# EAGLE design elevator_iopanel_revA (EAGLE 9.4.0)
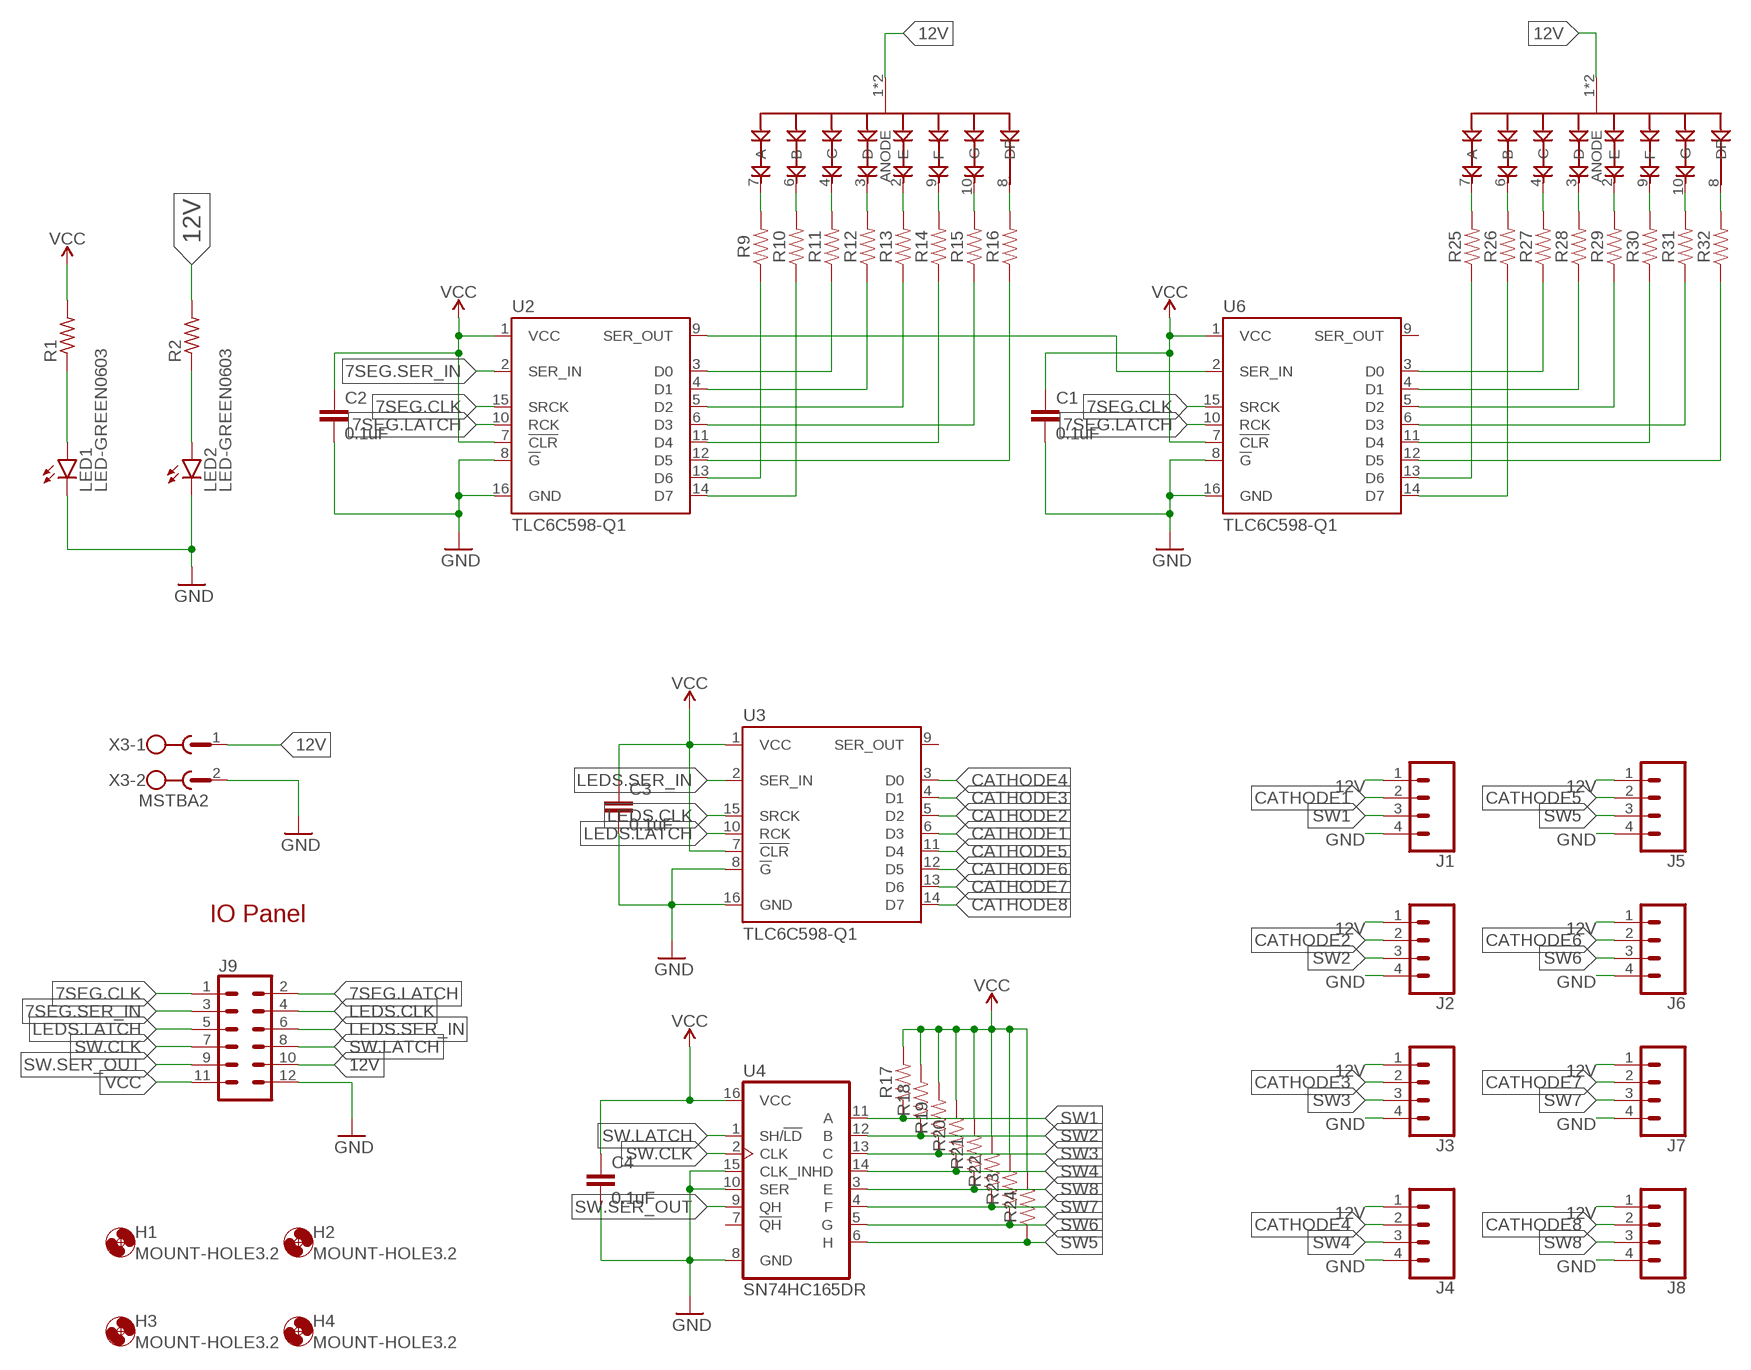
[diagram p0: schematic, sheet 1]

## Parts
C1  0.1uF  0.1UF-0603-25V-5%  [0603]
C2  0.1uF  0.1UF-0603-25V-5%  [0603]
C3  0.1uF  0.1UF-0603-25V-5%  [0603]
C4  0.1uF  0.1UF-0603-25V-5%  [0603]
D2  SA15-11EWA  [SA15-11EWA]
D4  SA15-11EWA  [SA15-11EWA]
H1  MOUNT-HOLE3.2  [3,2]
H2  MOUNT-HOLE3.2  [3,2]
H3  MOUNT-HOLE3.2  [3,2]
H4  MOUNT-HOLE3.2  [3,2]
J1  CONN_04LONGPADS  [1X04_LONGPADS]
J2  CONN_04LONGPADS  [1X04_LONGPADS]
J3  CONN_04LONGPADS  [1X04_LONGPADS]
J4  CONN_04LONGPADS  [1X04_LONGPADS]
J5  CONN_04LONGPADS  [1X04_LONGPADS]
J6  CONN_04LONGPADS  [1X04_LONGPADS]
J7  CONN_04LONGPADS  [1X04_LONGPADS]
J8  CONN_04LONGPADS  [1X04_LONGPADS]
J9  CONN_06X22X6SHR  [2X6-SHROUDED]
LED1  LED-GREEN0603  [0603-GREEN]
LED2  LED-GREEN0603  [0603-GREEN]
R1  R-US_R0603  [R0603]
R2  R-US_R0603  [R0603]
R9  20KOHM-0603-1/10W-1%  [0603]
R10  20KOHM-0603-1/10W-1%  [0603]
R11  20KOHM-0603-1/10W-1%  [0603]
R12  20KOHM-0603-1/10W-1%  [0603]
R13  20KOHM-0603-1/10W-1%  [0603]
R14  20KOHM-0603-1/10W-1%  [0603]
R15  20KOHM-0603-1/10W-1%  [0603]
R16  20KOHM-0603-1/10W-1%  [0603]
R17  20KOHM-0603-1/10W-1%  [0603]
R18  20KOHM-0603-1/10W-1%  [0603]
R19  20KOHM-0603-1/10W-1%  [0603]
R20  20KOHM-0603-1/10W-1%  [0603]
R21  20KOHM-0603-1/10W-1%  [0603]
R22  20KOHM-0603-1/10W-1%  [0603]
R23  20KOHM-0603-1/10W-1%  [0603]
R24  20KOHM-0603-1/10W-1%  [0603]
R25  20KOHM-0603-1/10W-1%  [0603]
R26  20KOHM-0603-1/10W-1%  [0603]
R27  20KOHM-0603-1/10W-1%  [0603]
R28  20KOHM-0603-1/10W-1%  [0603]
R29  20KOHM-0603-1/10W-1%  [0603]
R30  20KOHM-0603-1/10W-1%  [0603]
R31  20KOHM-0603-1/10W-1%  [0603]
R32  20KOHM-0603-1/10W-1%  [0603]
U2  TLC6C598-Q1  TPIC6C596SOIC  [SO16]
U3  TLC6C598-Q1  TPIC6C596SOIC  [SO16]
U4  SN74HC165DR  74HC165D  [SO16]
U6  TLC6C598-Q1  TPIC6C596SOIC  [SO16]
X3  MSTBA2  [MSTBA2]

## Nets
7SEG.CLK: J9.1 U2.15(SRCK) U6.15(SRCK)
7SEG.LATCH: J9.2 U2.10(RCK) U6.10(RCK)
7SEG.SER_IN: J9.3 U2.2(SER_IN)
12V: D2.1(ANODE) D2.5(ANODE) D4.1(ANODE) D4.5(ANODE) J1.1 J2.1 J3.1 J4.1 J5.1 J6.1 J7.1 J8.1 J9.10 R2.2 X3.1
A.SER_OUT: U2.9(SER_OUT) U6.2(SER_IN)
CATHODE1: J1.2 U3.6(D3)
CATHODE2: J2.2 U3.5(D2)
CATHODE3: J3.2 U3.4(D1)
CATHODE4: J4.2 U3.3(D0)
CATHODE5: J5.2 U3.11(D4)
CATHODE6: J6.2 U3.12(D5)
CATHODE7: J7.2 U3.13(D6)
CATHODE8: J8.2 U3.14(D7)
GND: C1.2 C2.2 C3.2 C4.2 J1.4 J2.4 J3.4 J4.4 J5.4 J6.4 J7.4 J8.4 J9.12 LED1.C LED2.C U2.8(!G) U2.16(GND) U3.8(!G) U3.16(GND) U4.8(GND) U4.10(SER) U4.15(CLK_INH) U6.8(!G) U6.16(GND) X3.2
LEDS.CLK: J9.4 U3.15(SRCK)
LEDS.LATCH: J9.5 U3.10(RCK)
LEDS.SER_IN: J9.6 U3.2(SER_IN)
N$1: LED1.A R1.1
N$2: LED2.A R2.1
N$17: D2.7(A) R9.2
N$18: D2.6(B) R10.2
N$19: D2.4(C) R11.2
N$20: D2.3(D) R12.2
N$21: D2.2(E) R13.2
N$22: D2.9(F) R14.2
N$23: D2.10(G) R15.2
N$24: D2.8(DP) R16.2
N$25: R11.1 U2.3(D0)
N$26: R12.1 U2.4(D1)
N$27: R13.1 U2.5(D2)
N$28: R15.1 U2.6(D3)
N$29: R14.1 U2.11(D4)
N$30: R16.1 U2.12(D5)
N$31: R9.1 U2.13(D6)
N$32: R10.1 U2.14(D7)
N$49: D4.7(A) R25.2
N$50: D4.6(B) R26.2
N$51: D4.4(C) R27.2
N$52: D4.3(D) R28.2
N$53: D4.2(E) R29.2
N$54: D4.9(F) R30.2
N$55: D4.10(G) R31.2
N$56: D4.8(DP) R32.2
N$57: R27.1 U6.3(D0)
N$58: R28.1 U6.4(D1)
N$59: R29.1 U6.5(D2)
N$60: R31.1 U6.6(D3)
N$61: R30.1 U6.11(D4)
N$62: R32.1 U6.12(D5)
N$63: R25.1 U6.13(D6)
N$64: R26.1 U6.14(D7)
SW1: J1.3 R17.1 U4.11(A)
SW2: J2.3 R18.1 U4.12(B)
SW3: J3.3 R19.1 U4.13(C)
SW4: J4.3 R20.1 U4.14(D)
SW5: J5.3 R24.1 U4.6(H)
SW6: J6.3 R23.1 U4.5(G)
SW7: J7.3 R22.1 U4.4(F)
SW8: J8.3 R21.1 U4.3(E)
SW.CLK: J9.7 U4.2(CLK)
SW.LATCH: J9.8 U4.1(SH/!LD)
SW.SER_OUT: J9.9 U4.9(QH)
VCC: C1.1 C2.1 C3.1 C4.1 J9.11 R1.2 R17.2 R18.2 R19.2 R20.2 R21.2 R22.2 R23.2 R24.2 U2.1(VCC) U2.7(!CLR) U3.1(VCC) U3.7(!CLR) U4.16(VCC) U6.1(VCC) U6.7(!CLR)
Unconnected: U3.9(SER_OUT) U4.7(!QH) U6.9(SER_OUT)

## Notes on the sheet
- IO Panel

## Library data of the parts
C1-C4 = SparkFun-Capacitors:0.1UF: 0.1µF ceramic capacitors A capacitor is a passive two-terminal electrical component used to store electrical energy temporarily in an electric field.; PROD_ID: CAP-08604
D2 D4 = shlomo:SA15-11EWA
H1-H4 = holes:MOUNT-HOLE: MOUNTING HOLE with drill center marker
J1-J8 = SparkFun-Connectors:CONN_04: Multi connection point. Often used as Generic Header-pin footprint for 0.1 inch spaced/style header connections On any of the 0.1 inch spaced packages, you can populate with these: Break Away Headers - Straight <https://www.sparkfun.com/products/116> (PRT-00116) Break Away Male Headers - Right Angle <https://www.sparkfun.com/products/553> (PRT-00553) Female Headers <https://www.sparkfun.com/products/115> (PRT-00115) Break Away Headers - Machine Pin <https://www.sparkfun.com/products/117> (PRT-00117) Break Away Female Headers - Swiss Machine Pin <https://www.sparkfun.com/products/743> (PRT-00743) For SCREWTERMINALS and SPRING TERMINALS visit here: Screw Terimnals on SparkFun.com <https://www.sparkfun.com/search/results?term=Screw+Terminals> (5mm/3.5mm/2.54mm spacing) This device is also useful as a general connection point to wire up your design to another part of your project. Our various solder wires solder well into these plated through hole pads. Hook-Up Wire - Assortment (Stranded, 22 AWG) <https://www.sparkfun.com/products/11375> (PRT-11375) Hook-Up Wire - Assortment (Solid Core, 22 AWG) <https://www.sparkfun.com/products/11367> (PRT-11367) View the entire wire category on our website here <https://www.sparkfun.com/categories/141> Special notes: Molex polarized connector foot print use with SKU : PRT-08231 with associated crimp pins and housings. 1MM SMD Version SKU: PRT-10208; PROD_ID: CONN-09696
J9 = SparkFun-Connectors:CONN_06X2: Multi connection point. Often used as Generic Header-pin footprint for 0.1 inch spaced/style header connections On any of the 0.1 inch spaced packages, you can populate with these: Break Away Headers - Straight <https://www.sparkfun.com/products/116> (PRT-00116) Break Away Male Headers - Right Angle <https://www.sparkfun.com/products/553> (PRT-00553) Female Headers <https://www.sparkfun.com/products/115> (PRT-00115) Break Away Headers - Machine Pin <https://www.sparkfun.com/products/117> (PRT-00117) Break Away Female Headers - Swiss Machine Pin <https://www.sparkfun.com/products/743> (PRT-00743)
LED1 LED2 = BeagleBone_Blue_R3:LED-GREEN
R1 R2 = adafruit:R-US_: RESISTOR, American symbol
R9-R32 = SparkFun-Resistors:20KOHM: 20kΩ resistor A resistor is a passive two-terminal electrical component that implements electrical resistance as a circuit element. Resistors act to reduce current flow, and, at the same time, act to lower voltage levels within circuits. - Wikipedia; PROD_ID: RES-09383; VALUE: 20k
U2 U3 U6 = SparkFun-IC-Logic:TPIC6C596: Serial in shift register with open collector outputs This can sink up to 100mA per channel Datasheet <https://cdn.sparkfun.com/datasheets/Widgets/TPIC6C596.pdf> SparkFun Products SparkFun Large Digit Driver <https://www.sparkfun.com/products/13279> (WIG-13279); PROD_ID: IC-12522; VALUE: TPIC6C596
U4 = SparkFun-IC-Logic:74*165: 8-Bit Shift Register (Parallel to Serial) Datasheet <https://cdn.sparkfun.com/datasheets/BreakoutBoards/sn54hc165.pdf> SparkFun Products SparkFun Shift-In Breakout - SN74HC165 <https://www.sparkfun.com/products/11733> (BOB-11733); PROD_ID: IC-11325
X3 = con-phoenix-508:MSTBA2: PHOENIX; MF: FARNELL; MPN: 1757242; OC_FARNELL: 3705171; OC_NEWARK: 71C4161

## Board
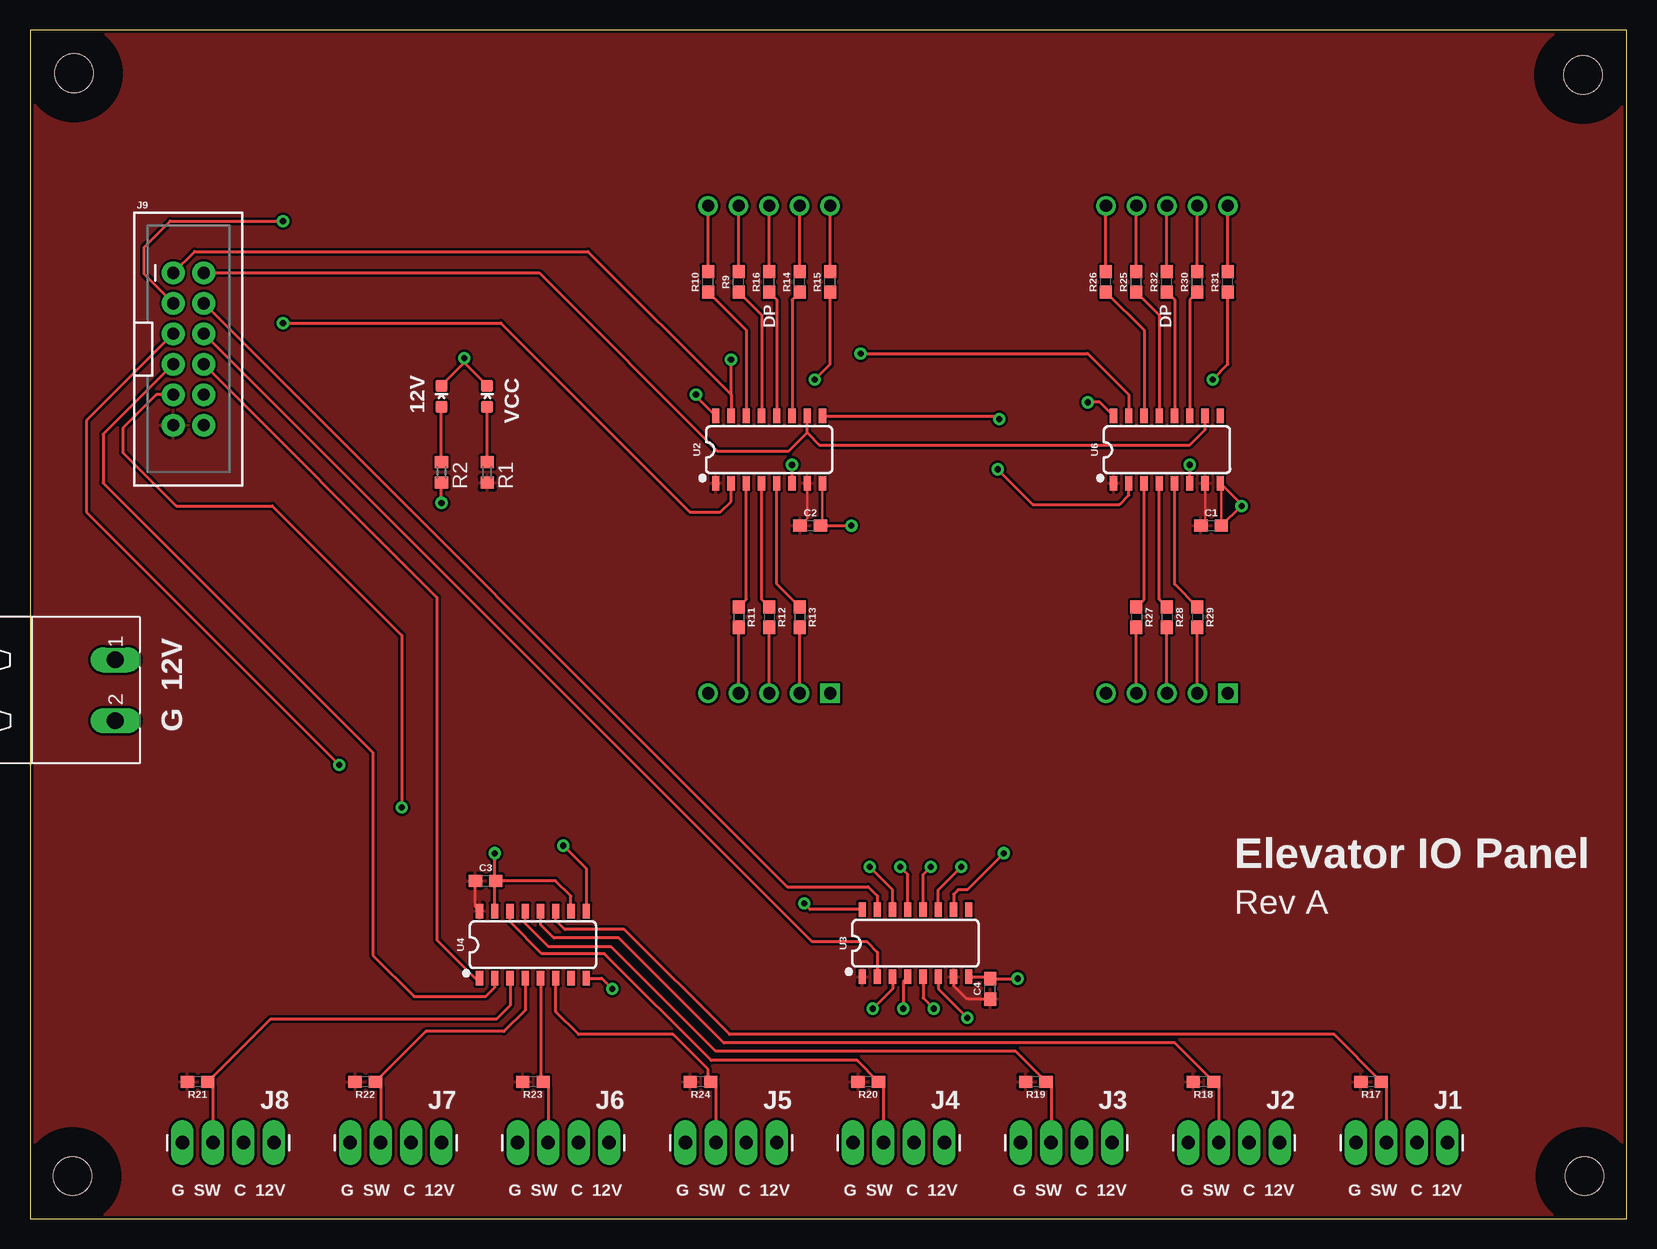
[diagram p1: board, top side]
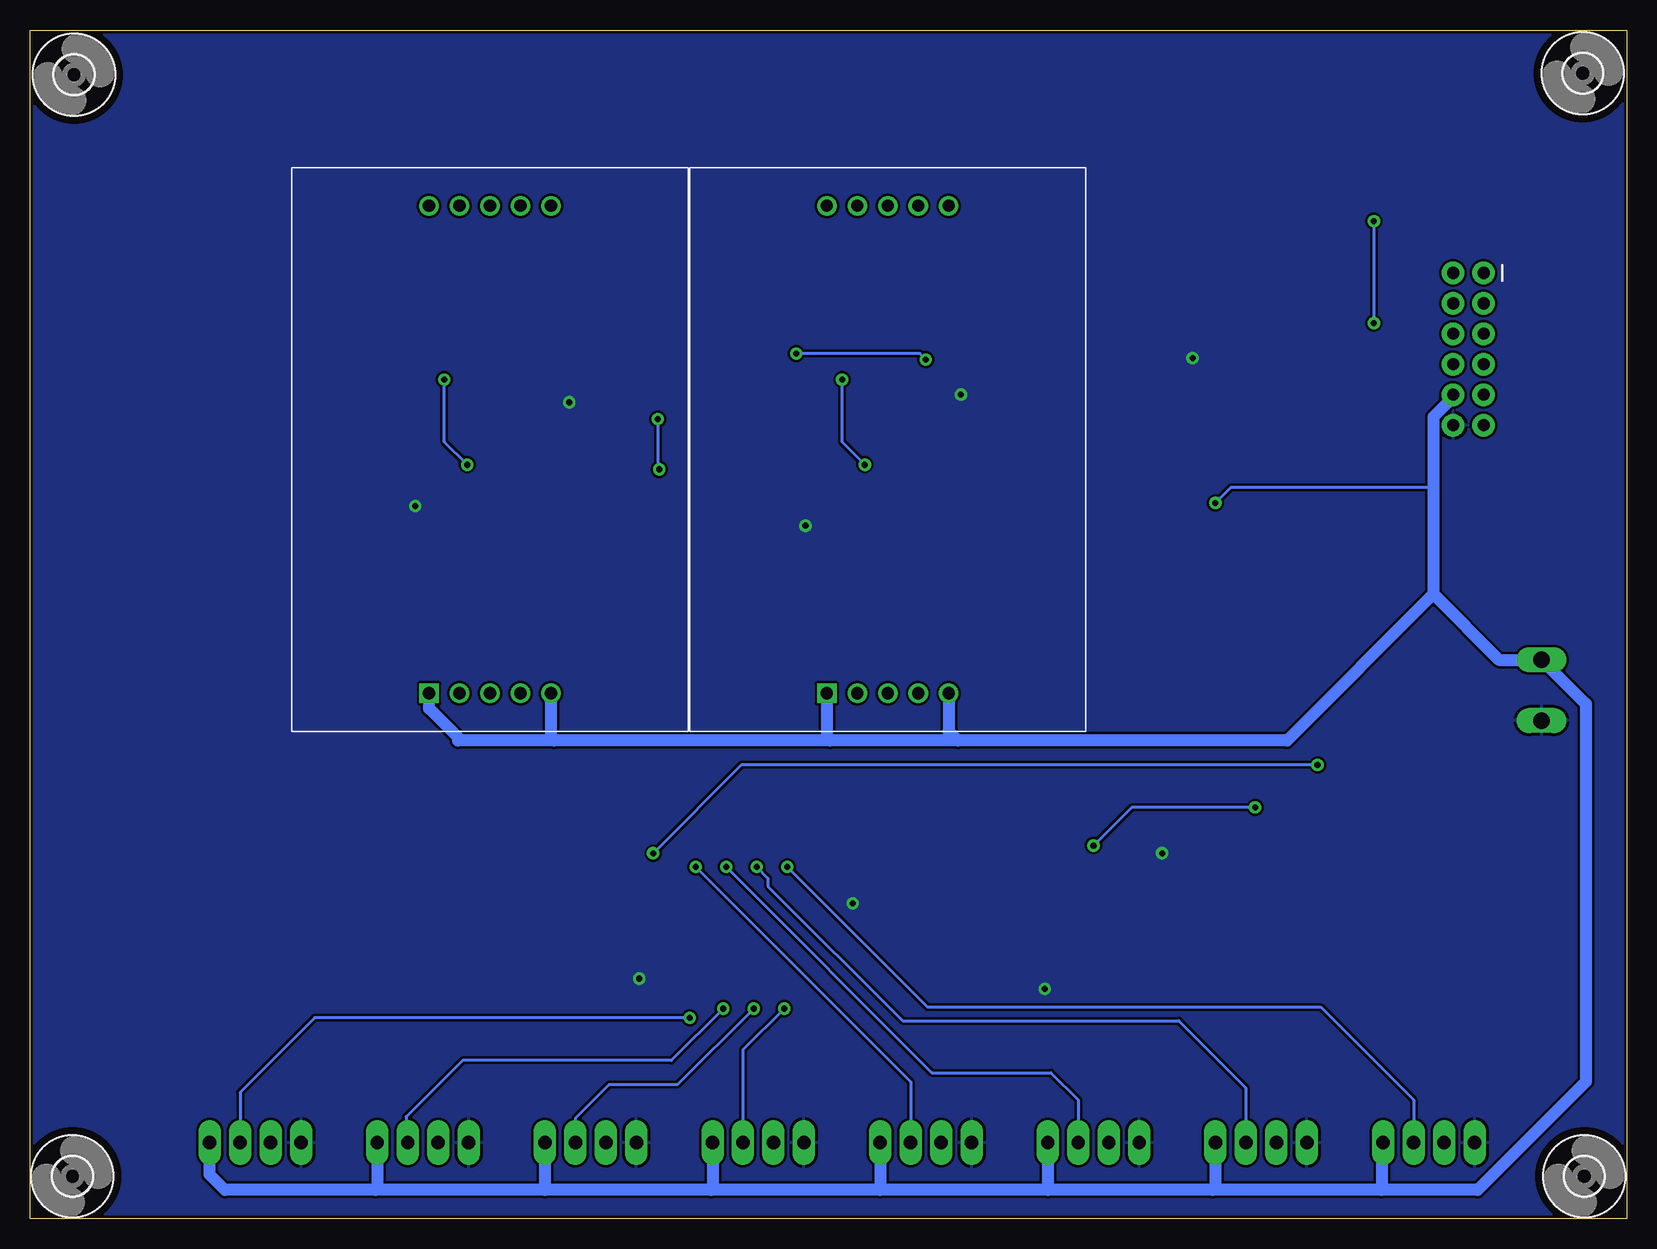
[diagram p2: board, bottom side, seen from below]

Size 133.08 x 99.11 mm. Coordinates in mm from the lower left corner, seen from the top.
Outline: 0,0 133.08,0 133.08,99.11 0,99.11 0,0
Copper layers (1*16): Top 0.035mm / dielectric 1.5mm / Bottom 0.035mm
Design rules "SparkFun": minimum track width 8mil, minimum drill 20mil, track to track 8mil, track to pad 8mil, pad to pad 8mil, via to via 8mil, smd to smd 8mil, copper to edge 10mil, drill to drill 8mil, minimum pad ring 12mil, minimum via ring 10mil, stop-mask expansion 4mil, vias tented up to drill 25mil, thermal gap 10mil

### Footprints (pad centres in the part's own frame; a part is rotated, then mirrored left to right if it is on the bottom)
0603 = smd 1.1 x 1: 1 -0.85,0; 2 0.85,0
SA15-11EWA = drill 1.016 square: 1 -5.08,-20.32 | drill 1.016: 2 -2.54,-20.32; 3 0,-20.32; 4 2.54,-20.32; 5 5.08,-20.32; 6 5.08,20.32; 7 2.54,20.32; 8 0,20.32; 9 -2.54,20.32; 10 -5.08,20.32
3,2 = hole 3.2: 0,0
1X04_LONGPADS = drill 1.118 pad 1.88 long: 1 0,0; 2 2.54,0; 3 5.08,0; 4 7.62,0
2X6-SHROUDED = drill 1.016 pad 1.88: 1 -1.27,6.35; 2 1.27,6.35; 3 -1.27,3.81; 4 1.27,3.81; 5 -1.27,1.27; 6 1.27,1.27; 7 -1.27,-1.27; 8 1.27,-1.27; 9 -1.27,-3.81; 10 1.27,-3.81; 11 -1.27,-6.35; 12 1.27,-6.35
0603-GREEN = smd 1 x 1: A 0,-0.877; C 0,0.877
R0603 = smd 1 x 1.1: 1 -0.85,0; 2 0.85,0
SO16 = smd 0.6 x 1.2: 1 -4.445,-2.8; 2 -3.175,-2.8; 3 -1.905,-2.8; 4 -0.635,-2.8; 5 0.635,-2.8; 6 1.905,-2.8; 7 3.175,-2.8; 8 4.445,-2.8; 9 4.445,2.8; 10 3.175,2.8; 11 1.905,2.8; 12 0.635,2.8; 13 -0.635,2.8; 14 -1.905,2.8; 15 -3.175,2.8; 16 -4.445,2.8
MSTBA2 = drill 1.397 long: 1 -2.54,5.08; 2 2.54,5.08

### Placement (x,y rotation side)
C1  98.42,57.78 0 top
C2  65.02,57.78 0 top
C3  37.97,28.19 0 top
C4  80.01,19.18 90 top
D2  61.59,64.14 0 bottom
D4  94.74,64.14 0 bottom
H1  3.68,95.5 0 bottom
H2  129.41,95.38 0 bottom
H3  3.56,3.56 0 bottom
H4  129.54,3.56 0 bottom
J1  118.11,6.35 180 top
J2  104.14,6.35 180 top
J3  90.17,6.35 180 top
J4  76.2,6.35 180 top
J5  62.23,6.35 180 top
J6  48.26,6.35 180 top
J7  34.29,6.35 180 top
J8  20.32,6.35 180 top
J9  13.21,72.52 0 top
LED1  38.1,68.58 0 top
LED2  34.29,68.58 0 top
R1  38.1,62.23 270 top
R2  34.29,62.23 270 top
R9  59.05,78.11 90 top
R10  56.52,78.11 90 top
R11  59.05,50.16 270 top
R12  61.59,50.16 270 top
R13  64.14,50.16 270 top
R14  64.14,78.11 90 top
R15  66.67,78.11 90 top
R16  61.59,78.11 90 top
R17  111.76,11.43 180 top
R18  97.79,11.43 180 top
R19  83.82,11.43 180 top
R20  69.85,11.43 180 top
R21  13.97,11.43 180 top
R22  27.94,11.43 180 top
R23  41.91,11.43 180 top
R24  55.88,11.43 180 top
R25  92.2,78.11 90 top
R26  89.66,78.11 90 top
R27  92.2,50.16 270 top
R28  94.74,50.16 270 top
R29  97.28,50.16 270 top
R30  97.28,78.11 90 top
R31  99.82,78.11 90 top
R32  94.74,78.11 90 top
U2  61.59,64.14 0 top
U3  73.79,22.99 0 top
U4  41.91,22.86 0 top
U6  94.74,64.14 0 top
X3  2.03,44.07 270 top

### Tracks (layer width: path | path; a pad name or v marks a point on that pad's centre or on a via)
7SEG.CLK  (via drill 0.51)
  Top 0.254: J9.1 13.72,80.64 46.48,80.64 58.42,68.71 | 58.42,68.71 U2.15 | 58.42,68.71 v58.42,71.63 | v69.22,72.14 88.14,72.14 91.57,68.71 U6.15
  Bottom 0.254: v58.42,71.63 58.93,72.14 v69.22,72.14
7SEG.LATCH
  Top 0.254: J9.2 42.42,78.87 57.28,64.01 63.25,64.01 64.77,65.53 | 64.77,65.53 U2.10 | 64.77,65.53 65.79,64.52 96.65,64.52 97.92,65.79 U6.10
7SEG.SER_IN  (via drill 0.51)
  Top 0.254: J9.3 9.53,78.74 9.53,81.03 11.68,83.19 v21.08,83.19 | v21.08,74.68 39.24,74.68 54.99,58.93 57.53,58.93 58.42,59.82 U2.2
  Bottom 0.254: v21.08,83.19 v21.08,74.68
12V  (via drill 0.51)
  Top 0.254: v34.29,59.69 R2.2
  Bottom 0.254: 16.13,60.96 33.02,60.96 v34.29,59.69
  Bottom 1.016: J9.10 14.48,68.5 16.13,66.85 16.13,60.96 16.13,52.07 | 16.13,52.07 10.67,46.61 X3.1 3.43,42.93 3.43,11.43 12.45,2.41 20.45,2.41 | 20.45,2.41 34.54,2.41 | 34.54,2.41 48.26,2.41 | 48.26,2.41 62.23,2.41 | 62.23,2.41 76.33,2.41 | 76.33,2.41 90.17,2.41 | 90.17,2.41 104.27,2.41 | 104.27,2.41 116.84,2.41 118.11,3.68 J1.1 | J2.1 104.14,2.54 104.27,2.41 | J3.1 90.17,2.41 | J4.1 76.2,2.54 76.33,2.41 | J5.1 62.23,2.41 | J6.1 48.26,2.41 | J7.1 34.29,2.67 34.54,2.41 | J8.1 20.45,6.22 20.45,2.41 | 16.13,52.07 28.32,39.88 55.75,39.88 | 55.75,39.88 66.42,39.88 | 66.42,39.88 89.41,39.88 | 89.41,39.88 97.41,39.88 97.28,40.01 99.82,42.55 D4.1 | D4.5 89.66,40.13 89.41,39.88 | D2.1 66.67,40.13 66.42,39.88 | D2.5 56.52,40.64 55.75,39.88
A.SER_OUT  (via drill 0.51)
  Top 0.254: U2.9 80.51,66.94 v80.77,66.67 | v80.64,62.48 83.57,59.56 90.81,59.56 91.57,60.33 U6.2
  Bottom 0.254: v80.77,66.67 80.77,62.61 v80.64,62.48
CATHODE1  (via drill 0.51)
  Top 0.254: U3.6 75.69,19.18 v78.11,16.76
  Bottom 0.254: v78.11,16.76 109.35,16.76 115.57,10.54 J1.2
CATHODE2  (via drill 0.51)
  Top 0.254: U3.5 74.42,18.41 v75.31,17.53
  Bottom 0.254: v75.31,17.53 79.63,13.21 97.03,13.21 101.73,8.51 101.73,6.48 J2.2
CATHODE3  (via drill 0.51)
  Top 0.254: U3.4 72.77,19.81 v72.77,17.53
  Bottom 0.254: v72.77,17.53 79.12,11.18 84.84,11.18 87.63,8.38 J3.2
CATHODE4  (via drill 0.51)
  Top 0.254: U3.3 71.88,19.18 v70.23,17.53
  Bottom 0.254: v70.23,17.53 73.66,14.1 J4.2
CATHODE5  (via drill 0.51)
  Top 0.254: U3.11 75.69,27.43 v77.6,29.34
  Bottom 0.254: v77.6,29.34 59.69,11.43 J5.2
CATHODE6  (via drill 0.51)
  Top 0.254: U3.12 74.42,28.7 v75.06,29.34
  Bottom 0.254: v75.06,29.34 57.91,12.19 48.01,12.19 45.72,9.91 J6.2
CATHODE7  (via drill 0.51)
  Top 0.254: U3.13 73.15,28.7 v72.52,29.34
  Bottom 0.254: v72.52,29.34 71.58,28.4 71.58,27.72 60.37,16.51 37.34,16.51 31.75,10.92 J7.2
CATHODE8  (via drill 0.51)
  Top 0.254: U3.14 71.88,27.43 v69.98,29.34
  Bottom 0.254: v69.98,29.34 58.29,17.65 25.53,17.65 17.78,9.91 J8.2
GND  (via drill 0.51)
  Top 0.203: C2.2 66.04,57.95 U2.8 | C1.2 99.28,61.25 U6.8
  Top 0.254: U3.8 79.85,20.19 C4.2 v82.3,20.03 | U4.15 38.73,28.11 | 38.73,28.11 C3.2 43.79,28.19 45.08,26.91 U4.10 | C2.2 v68.45,57.78 | U2.16 55.5,68.59 v55.5,68.71 | U6.16 89.16,68.07 v88.14,68.07 | U6.8 100.97,59.56 v100.97,59.44 100.93,59.44 C1.2 | U3.16 65.02,25.79 v64.52,26.29 | U4.8 47.63,20.06 v48.51,19.18 | 38.73,28.11 v38.73,30.48 | LED2.C 36.2,71.36 | 36.2,71.36 v36.2,71.75 | LED1.C 36.2,71.36
  pour Bottom: -1.91,101.98 135.51,101.98 135.51,-3.56 -1.91,-3.56
LEDS.CLK
  Top 0.254: J9.4 63.12,27.69 69.85,27.69 70.61,26.92 U3.15
LEDS.LATCH  (via drill 0.51)
  Top 0.254: J9.5 4.7,66.55 4.7,58.93 v25.78,37.85 | v81.15,30.48 78.11,27.43 77.34,27.43 76.96,27.05 U3.10
  Bottom 0.254: v25.78,37.85 73.79,37.85 v81.15,30.48
LEDS.SER_IN
  Top 0.254: J9.6 65.15,23.11 69.72,23.11 70.61,22.23 U3.2
N$1
  Top 0.254: R1.1 LED1.A
N$2
  Top 0.254: R2.1 LED2.A
N$17
  Top 0.254: R9.2 D2.7
N$18
  Top 0.254: R10.2 D2.6
N$19
  Top 0.254: D2.4 R11.2
N$20
  Top 0.254: D2.3 R12.2
N$21
  Top 0.254: D2.2 R13.2
N$22
  Top 0.254: R14.2 D2.9
N$23
  Top 0.254: R15.2 D2.10
N$24
  Top 0.254: R16.2 D2.8
N$25
  Top 0.254: R11.1 59.69,51.65 U2.3
N$26
  Top 0.254: R12.1 60.96,51.65 U2.4
N$27
  Top 0.254: R13.1 62.23,52.92 U2.5
N$28  (via drill 0.51)
  Top 0.254: U2.6 v63.5,62.87 | v65.41,69.98 66.67,71.25 R15.1
  Bottom 0.254: v63.5,62.87 65.41,64.77 v65.41,69.98
N$29
  Top 0.254: R14.1 63.5,76.62 U2.11
N$30
  Top 0.254: R16.1 62.23,76.62 U2.12
N$31
  Top 0.254: R9.1 60.96,75.35 U2.13
N$32
  Top 0.254: R10.1 59.69,74.08 U2.14
N$49
  Top 0.254: R25.2 D4.7
N$50
  Top 0.254: R26.2 D4.6
N$51
  Top 0.254: D4.4 R27.2
N$52
  Top 0.254: D4.3 R28.2
N$53
  Top 0.254: D4.2 R29.2
N$54
  Top 0.254: R30.2 D4.9
N$55
  Top 0.254: R31.2 D4.10
N$56
  Top 0.254: R32.2 D4.8
N$57
  Top 0.254: R27.1 92.84,51.65 U6.3
N$58
  Top 0.254: R28.1 94.11,51.65 U6.4
N$59
  Top 0.254: R29.1 95.38,52.92 U6.5
N$60  (via drill 0.51)
  Top 0.254: U6.6 v96.65,62.87 | v98.55,69.98 99.82,71.25 R31.1
  Bottom 0.254: v96.65,62.87 98.55,64.77 v98.55,69.98
N$61
  Top 0.254: R30.1 96.65,76.62 U6.11
N$62
  Top 0.254: R32.1 95.38,76.62 U6.12
N$63
  Top 0.254: R25.1 94.11,75.35 U6.13
N$64
  Top 0.254: R26.1 92.84,74.08 U6.14
SW1
  Top 0.254: U4.11 43.81,24.89 44.58,24.13 49.53,24.13 58.29,15.37 108.67,15.37 R17.1 113.03,11.01 J1.3
SW2
  Top 0.254: U4.12 42.55,24.51 43.65,23.4 49.08,23.4 57.83,14.66 95.41,14.66 R18.1 99.06,11.01 J2.3
SW3
  Top 0.254: U4.13 41.28,24.62 43.21,22.69 48.43,22.69 57.15,13.97 82.13,13.97 R19.1 85.09,11.01 J3.3
SW4
  Top 0.254: U4.14 40.01,24.77 42.66,22.11 47.87,22.11 56.77,13.21 68.92,13.21 R20.1 71.12,11.01 J4.3
SW5
  Top 0.254: U4.6 43.81,17.27 45.72,15.37 53.59,15.37 56.52,12.45 56.52,11.64 R24.1 57.15,11.01 J5.3
SW6
  Top 0.254: U4.5 42.55,11.64 R23.1 43.18,11.01 J6.3
SW7
  Top 0.254: U4.4 41.27,17.4 39.5,15.62 32.98,15.62 R22.1 29.21,11.01 J7.3
SW8
  Top 0.254: U4.3 40.01,17.78 38.86,16.64 20.03,16.64 R21.1 15.24,11.01 J8.3
SW.CLK
  Top 0.254: J9.7 6.1,65.41 6.1,61.34 28.57,38.86 28.57,21.97 32,18.54 37.97,18.54 38.73,19.3 U4.2
SW.LATCH
  Top 0.254: J9.8 33.91,51.82 33.91,23.24 37.09,20.06 U4.1
SW.SER_OUT  (via drill 0.51)
  Top 0.254: J9.9 10.54,68.71 7.75,65.91 7.75,63.88 12.19,59.44 20.19,59.44 30.99,48.64 v30.99,34.29 | v44.45,31.11 46.35,29.21 U4.9
  Bottom 0.254: v30.99,34.29 41.27,34.29 v44.45,31.11
VCC
  Top 0.203: C2.1 64.77,58.38 U2.7 | C1.1 97.92,58.13 U6.7
  Top 0.254: U3.7 76.96,19.43 78.03,18.36 78.2,18.36 78.23,18.33 C4.1 | U4.16 37.12,26 C3.1
  pour Top: -1.91,101.98 135.51,101.98 135.51,-3.56 -1.91,-3.56

### Text on the board
tPlace: DP | DP | 12V | VCC | G 12V | Elevator IO Panel | Rev A | G SW C 12V | G SW C 12V | G SW C 12V | G SW C 12V | G SW C 12V | G SW C 12V | G SW C 12V | G SW C 12V